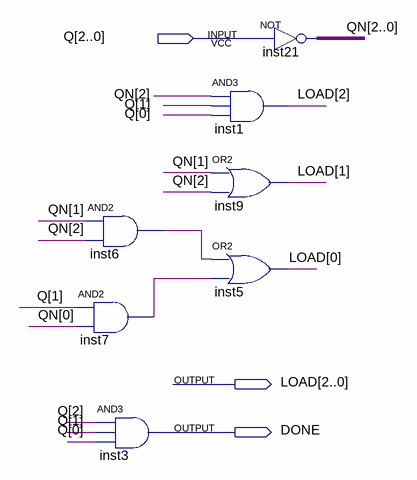
[diagram p0: schematic sheet]
// Quartus schematic OUTPUTLOGIC.bdf as structural Verilog: 7 symbols, 3 pins
module OUTPUTLOGIC (
  input  [2:0] Q,
  output [2:0] LOAD,
  output DONE
);

  wire inst6_out, inst7_out;
  wire [2:0] QN;

  and inst6 (inst6_out, QN[1], QN[2]);
  and inst7 (inst7_out, Q[1], QN[0]);
  and inst3 (DONE, Q[2], Q[1], Q[0]);
  assign QN = ~Q;  // NOT inst21, 3 bits wide
  and inst1 (LOAD[2], QN[2], Q[1], Q[0]);
  or inst9 (LOAD[1], QN[1], QN[2]);
  or inst5 (LOAD[0], inst6_out, inst7_out);
endmodule
